# Altium project comport.PrjPCB
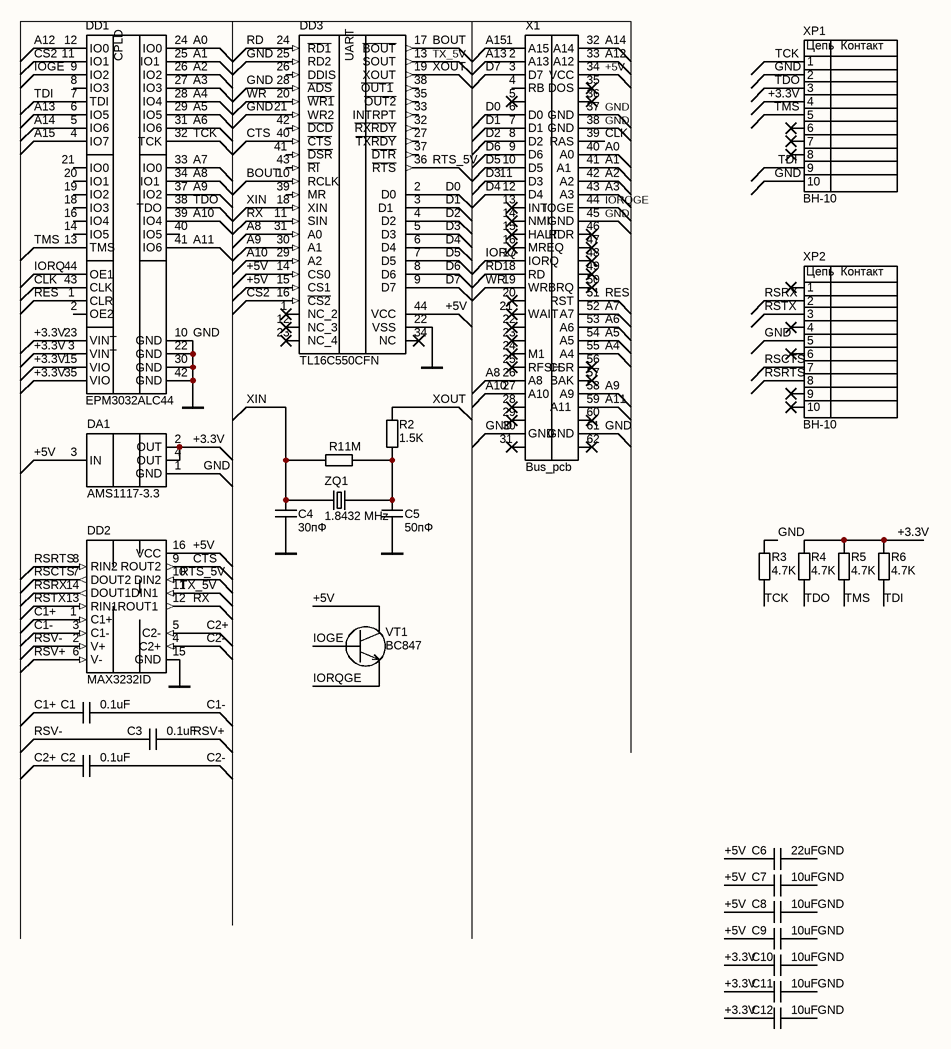
[diagram p0: main.SchDoc]
1 sheet, 27 parts. Net scope: global (net labels, ports and power ports of the same name join across sheets).
Board file: pcb.PcbDoc

## Sheet main.SchDoc
size 209 x 297 mm; Address1: Address1; Address2: Address2; Address3: Address3; Address4: Address4; SheetNumber: 1; SheetTotal: 1; Scale: 1:1; Разраб.: Михаил Каа; Обозначение документа: ZX_COM.001 Э3; Пров.: no check; Утв.: chat; Номер листа: 1; Общее количество листов: 1; Наименование организации: Михаил Каа; Перв. применение: ZXCOM.001; Наименование изделия 1: COM по Кондратьеву; Наименование изделия 2: Схема электрическая; Наименование изделия 3: принципиальная; Нач. отд.: Нач. отд.; Фамилия нач. отд.: chat

### Parts
C1  0.1uF  [C0805]
C2  0.1uF  [C0805]
C3  0.1uF  [C0805]
C4  30пФ  [C0805]
C5  50пФ  [C0805]
C6  22uF  [С1206]
C7  10uF  [C0805]
C8  10uF  [C0805]
C9  10uF  [C0805]
C10  10uF  [C0805]
C11  10uF  [C0805]
C12  10uF  [C0805]
DA1  AMS1117-3.3  [SOT229P700X180-4N]
DD1  EPM3032ALC44  [PLCC-44-R]
DD2  MAX3232ID  [SOIC127P600X175-16N]
DD3  TL16C550CFN  [PLCC-44-R]
R1  1M  [R0805]
R2  1.5K  [R0805]
R3  4.7K  [R0805]
R4  4.7K  [R0805]
R5  4.7K  [R0805]
R6  4.7K  [R0805]
VT1  BC847  [BC847]
X1  Bus_pcb  [BUS]  (no BOM)
XP1  BH-10  [BH-10]
XP2  BH-10  [BH-10]
ZQ1  1.8432 MHz  [XTAL_HC-49U]

### Nets
GND: C4.1 C5.1 C6.2 C7.2 C8.2 C9.2 C10.2 C11.2 C12.2 DA1.1(GND) DD1.10(GND) DD1.22(GND) DD1.30(GND) DD1.42(GND) DD2.15(GND) DD3.21(WR2) DD3.22(VSS) DD3.25(RD2) DD3.28(~{ADS}) R3.2 X1.30(GND) X1.37(GND) X1.38(GND) X1.45(GND) X1.61(GND) XP1.2 XP1.10 XP2.5
+3.3V: C10.1 C11.1 C12.1 DA1.2(OUT) DA1.4(OUT) DD1.3(VINT) DD1.15(VIO) DD1.23(VINT) DD1.35(VIO) R4.2 R5.2 R6.2 XP1.4
+5V: C6.1 C7.1 C8.1 C9.1 DA1.3(IN) DD2.16(VCC) DD3.14(CS0) DD3.15(CS1) DD3.44(VCC) VT1.3(C) X1.34(VCC)
A0: DD1.24(IO0) X1.40(A0)
A1: DD1.25(IO1) X1.41(A1)
A2: DD1.26(IO2) X1.42(A2)
A3: DD1.27(IO3) X1.43(A3)
A4: DD1.28(IO4) X1.55(A4)
A5: DD1.29(IO5) X1.54(A5)
A6: DD1.31(IO6) X1.53(A6)
A7: DD1.33(IO0) X1.52(A7)
A8: DD1.34(IO1) DD3.31(A0) X1.26(A8)
A9: DD1.37(IO2) DD3.30(A1) X1.58(A9)
A10: DD1.39(IO4) DD3.29(A2) X1.27(A10)
A11: DD1.41(IO6) X1.59(A11)
A12: DD1.12(IO0) X1.33(A12)
A13: DD1.6(IO5) X1.2(A13)
A14: DD1.5(IO6) X1.32(A14)
A15: DD1.4(IO7) X1.1(A15)
BOUT: DD3.10(RCLK) DD3.17(~{BOUT})
C1+: C1.1 DD2.1(C1+)
C1-: C1.2 DD2.3(C1-)
C2+: C2.1 DD2.5(C2-)
C2-: C2.2 DD2.4(C2+)
CLK: DD1.43(CLK) X1.39(RAS)
CS2: DD1.11(IO1) DD3.16(~{CS2})
CTS: DD2.9(ROUT2) DD3.40(~{CTS})
D0: DD3.2(D0) X1.6(D0)
D1: DD3.3(D1) X1.7(D1)
D2: DD3.4(D2) X1.8(D2)
D3: DD3.5(D3) X1.11(D3)
D4: DD3.6(D4) X1.12(D4)
D5: DD3.7(D5) X1.10(D5)
D6: DD3.8(D6) X1.9(D6)
D7: DD3.9(D7) X1.3(D7)
IOGE: DD1.9(IO2) VT1.1(B)
IORQ: DD1.44(OE1) X1.17(IORQ)
IORQGE: VT1.2(E) X1.44(IOGE)
RD: DD3.24(~{RD1}) X1.18(RD)
RES: DD1.1(CLR) X1.51(RST)
RSCTS: DD2.7(DOUT2) XP2.7
RSRTS: DD2.8(RIN2) XP2.8
RSRX: DD2.14(DOUT1) XP2.2
RSTX: DD2.13(RIN1) XP2.3
RSV+: C3.2 DD2.6(V-)
RSV-: C3.1 DD2.2(V+)
RTS_5V: DD2.10(DIN2) DD3.36(~{RTS})
RX: DD2.12(ROUT1) DD3.11(SIN)
TCK: DD1.32(TCK) R3.1 XP1.1
TDI: DD1.7(TDI) R6.1 XP1.9
TDO: DD1.38(TDO) R4.1 XP1.3
TMS: DD1.13(TMS) R5.1 XP1.5
TX_5V: DD2.11(DIN1) DD3.13(SOUT)
WR: DD3.20(~{WR1}) X1.19(WR)
XIN: C4.2 DD3.18(XIN) R1.1 ZQ1.1
XOUT: DD3.19(XOUT) R2.2
NetC5_2: C5.2 R1.2 R2.1 ZQ1.2

Not connected (* = marked no-connect by the designer): DD1 2(OE2) 8(IO3) 14(IO5) 16(IO4) 18(IO3) 19(IO2) 20(IO1) 21(IO0) 40(IO5); DD3 1(NC_2)* 12(NC_3)* 23(NC_4)* 26(DDIS) 27(~{TXRDY}) 32(~{RXRDY}) 33(INTRPT) 34(NC)* 35(~{OUT2}) 37(~{DTR}) 38(~{OUT1}) 39(MR) 41(~{DSR}) 42(~{DCD}) 43(~{RI}); X1 4(RB) 5* 13(INT)* 14(NMI)* 15(HALT)* 16(MREQ)* 20* 21(WAIT)* 22* 23* 24(M1)* 25(RFSH)* 28* 29* 31* 35(DOS)* 36* 46(RDR)* 47* 48* 49* 50(BRQ)* 56(CSR)* 57(BAK)* 60* 62*; XP1 6* 7* 8*; XP2 1* 4* 6* 9* 10*

### Notes on the sheet
- Перв. примен.
- Справ. №
- Подп. и дата
- Инв. № дубл.
- Взам. инв. №
- Разраб.
- Изм.
- Лист
- № докум.
- Подп.
- Дата
- Лит.
- Масса
- Масштаб
- Пров.
- Т.контр.
- Листов
- Инв. № подл.
- Утв.
- Н.контр.
- Копировал
- Формат А4
- (in symbol BH-10) Цепь; Контакт
- (in symbol EPM3032ALC44) CPLD
- (in symbol TL16C550CFN) UART

### Library data of the parts
C1-C12 = CapCer
DD1 = EPM3032ALC44: 44-Pin PLCC44
DD2 = MAX3232ID: 3-V to 5.5-V multichannel RS-232 line driver & receiver 16-SOIC -40 to 85; MF: Texas Instruments; Price: None; Value: *; Package: SOIC-16 Texas Instruments; Mouser-Purchase-URL: https://snapeda.com/shop?store=Mouser&id=215166; SnapEDA_Link: https://www.snapeda.com/parts/MAX3232ID/Texas%20Instruments/view-part/215166/?ref=snap; DigiKey-Purchase-URL: https://snapeda.com/shop?store=DigiKey&id=215166; MP: MAX3232ID; Texas_Instruments-Purchase-URL: https://snapeda.com/shop?store=Texas+Instruments&id=215166; Availability: Good
DD3 = TL16C550CFN: ASYNCHRONOUS COMMUNICATIONS ELEMENT; Package: None; Price: None; Value: *; MP: TL16C550CFN; Availability: Unavailable
R1-R6 = Res
VT1 = BC847: NPN Transistor
XP1 XP2 = BH-10: 10 Position Total Dual Row 2.54 mm Pitch Straight Male Shrouded Box Header; MF: Sullins Connector; MP: SBH11-PBPC-D05-ST-BK; SnapEDA_Link: https://www.snapeda.com/parts/SBH11-PBPC-D05-ST-BK/Sullins+Connector+Solutions/view-part/?ref=snap; Package: None; Value: *; Check_prices: https://www.snapeda.com/parts/SBH11-PBPC-D05-ST-BK/Sullins+Connector+Solutions/view-part/?ref=eda
ZQ1 = HC-49U_1.8432